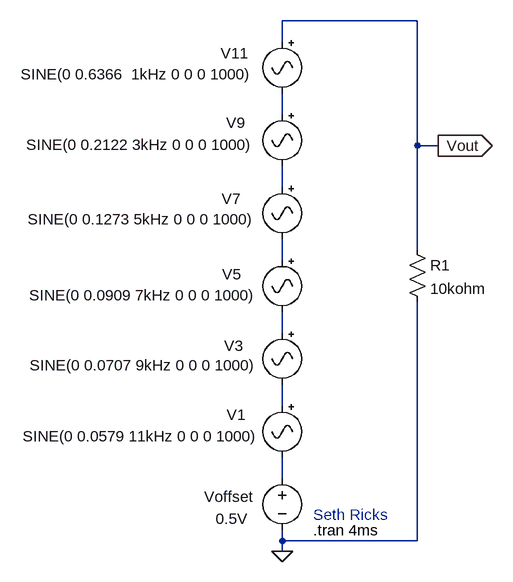
[diagram p0: schematic Draft1.asc]
Draft1.asc, the LTspice schematic file:
Version 4.1
SHEET 1 880 680
WIRE 112 -176 -96 -176
WIRE -96 -144 -96 -176
WIRE -96 -32 -96 -64
WIRE 112 16 112 -176
WIRE 144 16 112 16
WIRE -96 80 -96 48
WIRE 112 176 112 16
WIRE -96 192 -96 160
WIRE -96 304 -96 272
WIRE -96 416 -96 384
WIRE -96 528 -96 496
WIRE -96 624 -96 608
WIRE 112 624 112 256
WIRE 112 624 -96 624
WIRE -96 640 -96 624
FLAG -96 640 0
FLAG 144 16 Vout
IOPIN 144 16 Out
SYMBOL Misc\\signal -96 400 M0
WINDOW 0 56 30 Left 2
WINDOW 3 36 63 Left 2
SYMATTR InstName V1
SYMATTR Value SINE(0 0.0579 11kHz 0 0 0 1000)
SYMBOL Misc\\signal -96 288 M0
WINDOW 0 60 36 Left 2
WINDOW 3 39 66 Left 2
SYMATTR InstName V3
SYMATTR Value SINE(0 0.0707 9kHz 0 0 0 1000)
SYMBOL Misc\\signal -96 176 M0
WINDOW 0 63 38 Left 2
WINDOW 3 40 70 Left 2
SYMATTR InstName V5
SYMATTR Value SINE(0 0.0909 7kHz 0 0 0 1000)
SYMBOL Misc\\signal -96 64 M0
WINDOW 0 64 34 Left 2
WINDOW 3 42 65 Left 2
SYMATTR InstName V7
SYMATTR Value SINE(0 0.1273 5kHz 0 0 0 1000)
SYMBOL Misc\\signal -96 -48 M0
WINDOW 0 57 29 Left 2
WINDOW 3 44 63 Left 2
SYMATTR InstName V9
SYMATTR Value SINE(0 0.2122 3kHz 0 0 0 1000)
SYMBOL Misc\\signal -96 -160 M0
WINDOW 0 52 34 Left 2
WINDOW 3 46 66 Left 2
SYMATTR InstName V11
SYMATTR Value SINE(0 0.6366  1kHz 0 0 0 1000)
SYMBOL voltage -96 512 M0
WINDOW 0 45 44 Left 2
WINDOW 3 53 78 Left 2
SYMATTR InstName Voffset
SYMATTR Value 0.5V
SYMBOL res 96 160 R0
SYMATTR InstName R1
SYMATTR Value 10kohm
TEXT -48 608 Left 2 !.tran 4ms
TEXT -48 584 Left 2 ;Seth Ricks

The netlist it stands for:
* Draft1.asc
V1 N005 N006 SINE(0 0.0579 11kHz 0 0 0 1000)
V3 N004 N005 SINE(0 0.0707 9kHz 0 0 0 1000)
V5 N003 N004 SINE(0 0.0909 7kHz 0 0 0 1000)
V7 N002 N003 SINE(0 0.1273 5kHz 0 0 0 1000)
V9 N001 N002 SINE(0 0.2122 3kHz 0 0 0 1000)
V11 Vout N001 SINE(0 0.6366  1kHz 0 0 0 1000)
Voffset N006 0 0.5V
R1 Vout 0 10kohm
.tran 4ms
* Seth Ricks
.backanno
.end